# Altium schematic sheet OBC_Connectors.SchDoc: Connectors
size A4; SheetNumber: 1; SheetTotal: 10
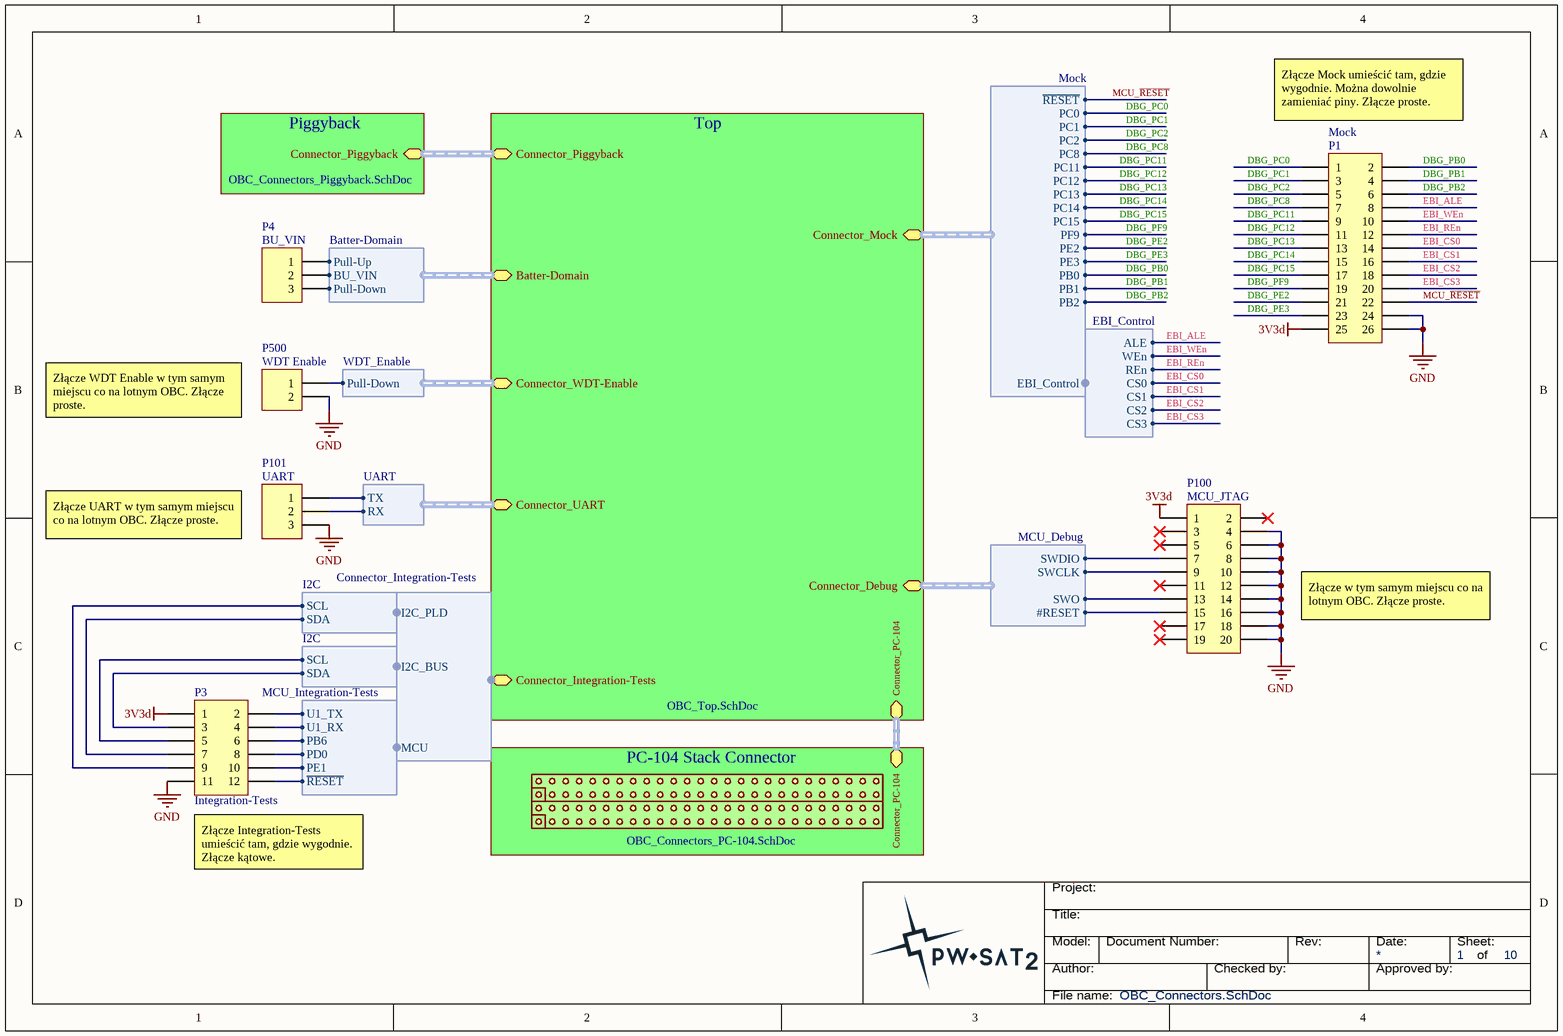
[diagram p0: OBC_Connectors.SchDoc]

## Parts
P1  Mock  [Samtec_TSW-113-07-L-D]
P3  Integration-Tests  [Samtec_TSW-106-07-L-D]
P4  BU_VIN  [Samtec_TSW-103-07-L-S]
P100  MCU_JTAG  [Samtec_TSS-110-01-G-D]
P101  UART  [Samtec_TSW-103-07-L-S]
P500  WDT Enable  [HEADER 1X2 Male]

## Sub-sheets
PC-104 Stack Connector = OBC_Connectors_PC-104.SchDoc: Connector_PC-104 (harness Connector_PC-104)
Piggyback = OBC_Connectors_Piggyback.SchDoc: Connector_Piggyback (harness Connector_Piggyback)
Top = OBC_Top.SchDoc: Connector_UART (harness UART), Connector_PC-104 (harness Connector_PC-104), Connector_Piggyback (harness Connector_Piggyback), Connector_Debug (harness MCU_Debug), Connector_Mock (harness Mock), Connector_Integration-Tests (harness Connector_Integration-Tests), Connector_WDT-Enable (harness WDT_Enable), Batter-Domain (harness Batter-Domain)

## Harnesses
UART: RX, TX
MCU_Debug: SWDIO, SWCLK, SWO, #RESET
Mock: PC14, PC15, PF9, PE2, PE3, PB0, PB1, PB2, EBI_Control, PC0, PC1, PC2, PC8, ~{RESET}, PC11, PC12, PC13
EBI_Control: ALE, WEn, REn, CS0, CS1, CS2, CS3
Connector_Integration-Tests: MCU, I2C_PLD, I2C_BUS
I2C: SDA, SCL
MCU_Integration-Tests: ~{RESET}, PB6, PD0, PE1, U1_TX, U1_RX
WDT_Enable: Pull-Down
Batter-Domain: BU_VIN, Pull-Up, Pull-Down

## Nets
3V3d: P1.25 P3.1 P100.1
GND: P1.24 P1.26 P3.11 P100.4 P100.6 P100.8 P100.10 P100.12 P100.14 P100.16 P100.18 P100.20 P101.3 P500.2
DBG_PB0: P1.2 ; sheet Top/Connector_Mock.PB0
DBG_PB1: P1.4 ; sheet Top/Connector_Mock.PB1
DBG_PB2: P1.6 ; sheet Top/Connector_Mock.PB2
DBG_PC0: P1.1 ; sheet Top/Connector_Mock.PC0
DBG_PC1: P1.3 ; sheet Top/Connector_Mock.PC1
DBG_PC2: P1.5 ; sheet Top/Connector_Mock.PC2
DBG_PC8: P1.7 ; sheet Top/Connector_Mock.PC8
DBG_PC11: P1.9 ; sheet Top/Connector_Mock.PC11
DBG_PC12: P1.11 ; sheet Top/Connector_Mock.PC12
DBG_PC13: P1.13 ; sheet Top/Connector_Mock.PC13
DBG_PC14: P1.15 ; sheet Top/Connector_Mock.PC14
DBG_PC15: P1.17 ; sheet Top/Connector_Mock.PC15
DBG_PE2: P1.21 ; sheet Top/Connector_Mock.PE2
DBG_PE3: P1.23 ; sheet Top/Connector_Mock.PE3
DBG_PF9: P1.19 ; sheet Top/Connector_Mock.PF9
EBI_ALE: P1.8 ; harness EBI_Control.ALE
EBI_CS0: P1.14 ; harness EBI_Control.CS0
EBI_CS1: P1.16 ; harness EBI_Control.CS1
EBI_CS2: P1.18 ; harness EBI_Control.CS2
EBI_CS3: P1.20 ; harness EBI_Control.CS3
EBI_REn: P1.12 ; harness EBI_Control.REn
EBI_WEn: P1.10 ; harness EBI_Control.WEn
MCU_~{RESET}: P1.22 ; sheet Top/Connector_Mock.~{RESET}
NetP3_2: P3.2 ; harness MCU_Integration-Tests.U1_TX
NetP3_3: P3.3 ; harness I2C.SDA
NetP3_4: P3.4 ; harness MCU_Integration-Tests.U1_RX
NetP3_5: P3.5 ; harness I2C.SCL
NetP3_6: P3.6 ; harness MCU_Integration-Tests.PB6
NetP3_7: P3.7 ; harness I2C.SDA
NetP3_8: P3.8 ; harness MCU_Integration-Tests.PD0
NetP3_9: P3.9 ; harness I2C.SCL
NetP3_10: P3.10 ; harness MCU_Integration-Tests.PE1
NetP3_12: P3.12 ; harness MCU_Integration-Tests.~{RESET}
NetP4_1: P4.1 ; sheet Top/Batter-Domain.Pull-Up
NetP4_2: P4.2 ; sheet Top/Batter-Domain.BU_VIN
NetP4_3: P4.3 ; sheet Top/Batter-Domain.Pull-Down
NetP100_7: P100.7 ; sheet Top/Connector_Debug.SWDIO
NetP100_9: P100.9 ; sheet Top/Connector_Debug.SWCLK
NetP100_13: P100.13 ; sheet Top/Connector_Debug.SWO
NetP100_15: P100.15 ; sheet Top/Connector_Debug.#RESET
NetP101_1: P101.1 ; sheet Top/Connector_UART.TX
NetP101_2: P101.2 ; sheet Top/Connector_UART.RX
NetP500_1: P500.1 ; sheet Top/Connector_WDT-Enable.Pull-Down

Not connected (* = marked no-connect by the designer): P100 2* 3* 5* 11* 17* 19*

## Buses and harness runs
harness sheet PC-104 Stack Connector/Connector_PC-104 = sheet Top/Connector_PC-104
harness sheet Piggyback/Connector_Piggyback = sheet Top/Connector_Piggyback

## Notes on the sheet
- (near P1) Złącze Mock umieścić tam, gdzie wygodnie. Można dowolnie zamieniać piny. Złącze proste.
- Złącze WDT Enable w tym samym miejscu co na lotnym OBC. Złącze proste.
- Złącze UART w tym samym miejscu co na lotnym OBC. Złącze proste.
- Złącze w tym samym miejscu co na lotnym OBC. Złącze proste.
- (near P3) Złącze Integration-Tests umieścić tam, gdzie wygodnie. Złącze kątowe.
- Title:
- Project:
- Author:
- Model:
- Document Number:
- Checked by:
- Rev:
- Date:
- Approved by:
- Sheet:
- of
- File name:

## Library data of the parts
P1 = Header 13X2: Header, 13-Pin, Dual row; partNo: 67997-426HLF; Manufacturer: Amphenol; Supplier 1: Farnell; Farnell: 1925216
P3 = Header 6X2: Header, 6-Pin, Dual row, Right Angle; partNo: MC34771; Manufacturer: Multicomp; Supplier 1: Farnell; Farnell: 1593452
P4 P101 = Header 3: Header, 3-Pin; partNo: 2211S-03G; Manufacturer: Multicomp; Supplier 1: Farnell; Farnell: 1593412
P100 = Header 10X2: Header, 10-Pin, Dual row; partNo: MC9A12-2034; Manufacturer: 3M; Supplier 1: Farnell; Farnell: 1099258
P500 = Header 2: Header, 2-Pin; Manufacturer: Multicomp; partNo: 2211S-02G; Farnell: 1593411; Supplier 1: Farnell